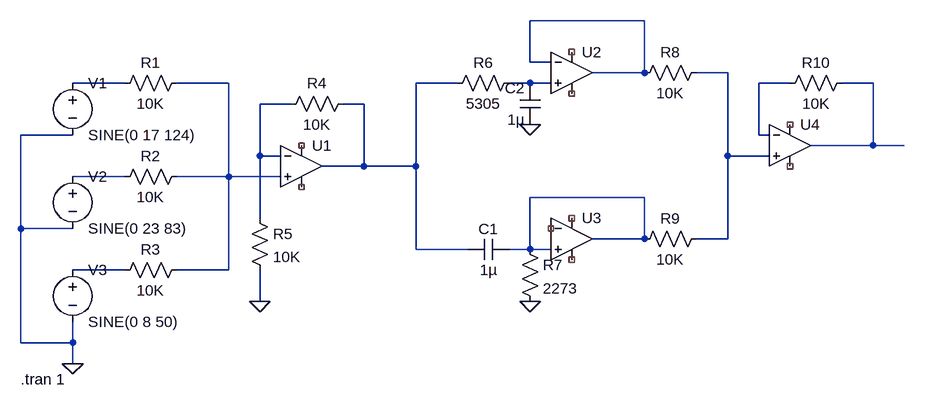
[diagram p0: schematic 50HzAttenuator(active).asc]
50HzAttenuator(active).asc, the LTspice schematic file:
Version 4.1
SHEET 1 1284 680
WIRE 880 -112 704 -112
WIRE 704 -48 704 -112
WIRE 736 -48 704 -48
WIRE 880 -32 880 -112
WIRE 880 -32 800 -32
WIRE 1008 -32 960 -32
WIRE 80 -16 0 -16
WIRE 240 -16 160 -16
WIRE 592 -16 528 -16
WIRE 704 -16 672 -16
WIRE 736 -16 704 -16
WIRE 1104 -16 1056 -16
WIRE 1232 -16 1184 -16
WIRE 336 16 288 16
WIRE 448 16 416 16
WIRE 0 64 -80 64
WIRE 1056 64 1056 -16
WIRE 1072 64 1056 64
WIRE 1232 80 1232 -16
WIRE 1232 80 1136 80
WIRE 1280 80 1232 80
WIRE 288 96 288 16
WIRE 320 96 288 96
WIRE 1008 96 1008 -32
WIRE 1072 96 1008 96
WIRE 448 112 448 16
WIRE 448 112 384 112
WIRE 528 112 528 -16
WIRE 528 112 448 112
WIRE 80 128 0 128
WIRE 240 128 240 -16
WIRE 240 128 160 128
WIRE 320 128 240 128
WIRE 880 160 704 160
WIRE 288 192 288 96
WIRE -80 208 -80 64
WIRE 0 208 -80 208
WIRE 880 224 880 160
WIRE 880 224 800 224
WIRE 1008 224 1008 96
WIRE 1008 224 960 224
WIRE 528 240 528 112
WIRE 608 240 528 240
WIRE 704 240 704 160
WIRE 704 240 672 240
WIRE 736 240 704 240
WIRE 80 272 0 272
WIRE 240 272 240 128
WIRE 240 272 160 272
WIRE 288 320 288 272
WIRE -80 384 -80 208
WIRE 0 384 0 352
WIRE 0 384 -80 384
WIRE 0 416 0 384
FLAG 0 416 0
FLAG 288 320 0
FLAG 704 48 0
FLAG 704 320 0
SYMBOL voltage 0 -32 R0
WINDOW 123 0 0 Left 0
WINDOW 39 0 0 Left 0
SYMATTR InstName V1
SYMATTR Value SINE(0 17 124)
SYMBOL voltage 0 112 R0
WINDOW 123 0 0 Left 0
WINDOW 39 0 0 Left 0
SYMATTR InstName V2
SYMATTR Value SINE(0 23 83)
SYMBOL voltage 0 256 R0
WINDOW 123 0 0 Left 0
WINDOW 39 0 0 Left 0
SYMATTR InstName V3
SYMATTR Value SINE(0 8 50)
SYMBOL OpAmps\\UniversalOpAmp 352 112 R0
SYMATTR InstName U1
SYMBOL res 176 -32 R90
WINDOW 0 0 56 VBottom 2
WINDOW 3 32 56 VTop 2
SYMATTR InstName R1
SYMATTR Value 10K
SYMATTR SpiceLine tol=1 pwr=0.1
SYMBOL res 176 112 R90
WINDOW 0 0 56 VBottom 2
WINDOW 3 32 56 VTop 2
SYMATTR InstName R2
SYMATTR Value 10K
SYMATTR SpiceLine tol=1 pwr=0.1
SYMBOL res 176 256 R90
WINDOW 0 0 56 VBottom 2
WINDOW 3 32 56 VTop 2
SYMATTR InstName R3
SYMATTR Value 10K
SYMATTR SpiceLine tol=1 pwr=0.1
SYMBOL res 432 0 R90
WINDOW 0 0 56 VBottom 2
WINDOW 3 32 56 VTop 2
SYMATTR InstName R4
SYMATTR Value 10K
SYMATTR SpiceLine tol=1 pwr=0.1
SYMBOL res 272 176 R0
SYMATTR InstName R5
SYMATTR Value 10K
SYMATTR SpiceLine tol=1 pwr=0.1
SYMBOL OpAmps\\UniversalOpAmp 768 -32 R0
SYMATTR InstName U2
SYMBOL OpAmps\\UniversalOpAmp 768 224 R0
SYMATTR InstName U3
SYMBOL res 688 -32 R90
WINDOW 0 0 56 VBottom 2
WINDOW 3 32 56 VTop 2
SYMATTR InstName R6
SYMATTR Value 5305
SYMBOL cap 672 224 R90
WINDOW 0 0 32 VBottom 2
WINDOW 3 32 32 VTop 2
SYMATTR InstName C1
SYMATTR Value 1µ
SYMATTR SpiceLine V=4 Irms=0 Rser=0 Lser=0 mfg="Murata" pn="GRM032R60G105ME05" type="X5R"
SYMBOL cap 720 48 R180
WINDOW 0 24 56 Left 2
WINDOW 3 24 8 Left 2
SYMATTR InstName C2
SYMATTR Value 1µ
SYMATTR SpiceLine V=4 Irms=0 Rser=0 Lser=0 mfg="Murata" pn="GRM032R60G105ME05" type="X5R"
SYMBOL res 688 224 R0
SYMATTR InstName R7
SYMATTR Value 2273
SYMBOL res 976 -48 R90
WINDOW 0 0 56 VBottom 2
WINDOW 3 32 56 VTop 2
SYMATTR InstName R8
SYMATTR Value 10K
SYMATTR SpiceLine tol=1 pwr=0.1
SYMBOL res 976 208 R90
WINDOW 0 0 56 VBottom 2
WINDOW 3 32 56 VTop 2
SYMATTR InstName R9
SYMATTR Value 10K
SYMATTR SpiceLine tol=1 pwr=0.1
SYMBOL OpAmps\\UniversalOpAmp 1104 80 R0
SYMATTR InstName U4
SYMBOL res 1200 -32 R90
WINDOW 0 0 56 VBottom 2
WINDOW 3 32 56 VTop 2
SYMATTR InstName R10
SYMATTR Value 10K
SYMATTR SpiceLine tol=1 pwr=0.1
TEXT -80 440 Left 2 !.tran 1

The netlist it stands for:
* 50HzAttenuator(active).asc
V1 N003 0 SINE(0 17 124)
V2 N010 0 SINE(0 23 83)
V3 N012 0 SINE(0 8 50)
X§U1 N004 N009 NC_01 NC_02 N005 level1 Avol=1Meg GBW=10Meg Vos=0 En=0 Enk=0 In=0 Ink=0 Rin=500Meg  ; pins In+ In- V+ V- OUT
R1 N004 N003 10K tol=1 pwr=0.1
R2 N004 N010 10K tol=1 pwr=0.1
R3 N004 N012 10K tol=1 pwr=0.1
R4 N005 N009 10K tol=1 pwr=0.1
R5 N009 0 10K tol=1 pwr=0.1
X§U2 N006 N001 NC_03 NC_04 N001 level1 Avol=1Meg GBW=10Meg Vos=0 En=0 Enk=0 In=0 Ink=0 Rin=500Meg  ; pins In+ In- V+ V- OUT
X§U3 N011 NC_05 NC_06 NC_07 N011 level1 Avol=1Meg GBW=10Meg Vos=0 En=0 Enk=0 In=0 Ink=0 Rin=500Meg  ; pins In+ In- V+ V- OUT
R6 N006 N005 5305
C1 N011 N005 1µ V=4 Irms=0 Rser=0 Lser=0 mfg="Murata" pn="GRM032R60G105ME05" type="X5R"
C2 0 N006 1µ V=4 Irms=0 Rser=0 Lser=0 mfg="Murata" pn="GRM032R60G105ME05" type="X5R"
R7 N011 0 2273
R8 N002 N001 10K tol=1 pwr=0.1
R9 N002 N011 10K tol=1 pwr=0.1
X§U4 N002 N007 NC_08 NC_09 N008 level1 Avol=1Meg GBW=10Meg Vos=0 En=0 Enk=0 In=0 Ink=0 Rin=500Meg  ; pins In+ In- V+ V- OUT
R10 N008 N007 10K tol=1 pwr=0.1
.tran 1
.lib UniversalOpAmp1.lib
.backanno
.end